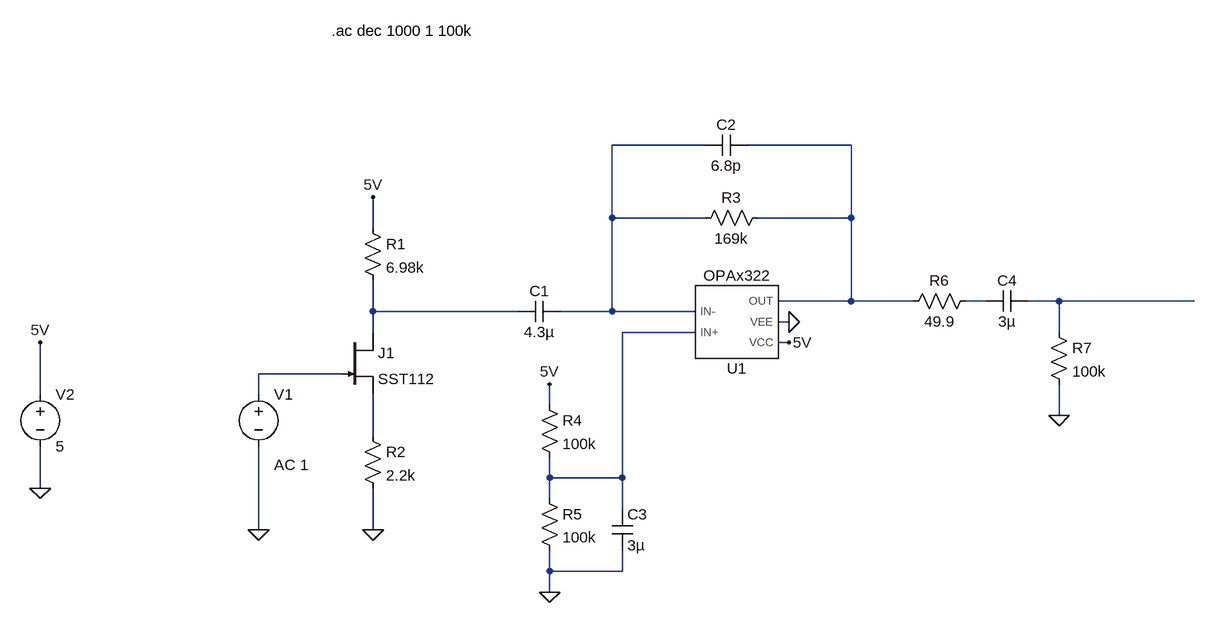
[diagram p0: schematic ac_response.asc]
ac_response.asc, the LTspice schematic file:
Version 4
SHEET 1 1476 680
WIRE 720 -176 576 -176
WIRE 944 -176 784 -176
WIRE 576 -64 576 -176
WIRE 720 -64 576 -64
WIRE 944 -64 944 -176
WIRE 944 -64 800 -64
WIRE 208 -48 208 -96
WIRE 944 64 944 -64
WIRE 944 64 832 64
WIRE 1040 64 944 64
WIRE 1152 64 1120 64
WIRE 1264 64 1216 64
WIRE 1472 64 1264 64
WIRE 208 80 208 32
WIRE 432 80 208 80
WIRE 576 80 576 -64
WIRE 576 80 496 80
WIRE 704 80 576 80
WIRE 848 96 832 96
WIRE 208 112 208 80
WIRE 704 112 592 112
WIRE 1264 112 1264 64
WIRE 848 128 832 128
WIRE 160 176 32 176
WIRE -304 208 -304 128
WIRE 32 208 32 176
WIRE 480 224 480 192
WIRE 1264 240 1264 192
WIRE 208 272 208 208
WIRE 480 336 480 304
WIRE 592 336 592 112
WIRE 592 336 480 336
WIRE -304 352 -304 288
WIRE 480 368 480 336
WIRE 592 384 592 336
WIRE 32 416 32 288
WIRE 208 416 208 352
WIRE 480 480 480 448
WIRE 592 480 592 448
WIRE 592 480 480 480
WIRE 480 512 480 480
FLAG 208 416 0
FLAG 32 416 0
FLAG -304 352 0
FLAG -304 128 5V
FLAG 208 -96 5V
FLAG 480 192 5V
FLAG 480 512 0
FLAG 848 128 5V
FLAG 848 96 0
FLAG 1264 240 0
SYMBOL njf 160 112 R0
SYMATTR InstName J1
SYMATTR Value SST112
SYMBOL OPAx322 768 96 M180
SYMATTR InstName U1
SYMATTR ModelFile C:\Users\aidan\Desktop\Projects\Microphone\Controlled\simulation\OPAx322.LIB
SYMBOL res 192 -64 R0
SYMATTR InstName R1
SYMATTR Value 6.98k
SYMBOL voltage 32 192 R0
WINDOW 123 24 124 Left 2
WINDOW 39 0 0 Left 0
SYMATTR InstName V1
SYMATTR Value ""
SYMATTR Value2 AC 1
SYMBOL res 192 256 R0
SYMATTR InstName R2
SYMATTR Value 2.2k
SYMBOL voltage -304 192 R0
WINDOW 123 0 0 Left 0
WINDOW 39 0 0 Left 0
SYMATTR InstName V2
SYMATTR Value 5
SYMBOL cap 496 64 R90
WINDOW 0 0 32 VBottom 2
WINDOW 3 32 32 VTop 2
SYMATTR InstName C1
SYMATTR Value 4.3µ
SYMBOL res 816 -80 R90
WINDOW 0 0 56 VBottom 2
WINDOW 3 32 56 VTop 2
SYMATTR InstName R3
SYMATTR Value 169k
SYMBOL cap 784 -192 R90
WINDOW 0 0 32 VBottom 2
WINDOW 3 32 32 VTop 2
SYMATTR InstName C2
SYMATTR Value 6.8p
SYMBOL res 464 208 R0
SYMATTR InstName R4
SYMATTR Value 100k
SYMBOL res 464 352 R0
SYMATTR InstName R5
SYMATTR Value 100k
SYMBOL cap 576 384 R0
SYMATTR InstName C3
SYMATTR Value 3µ
SYMBOL res 1136 48 R90
WINDOW 0 0 56 VBottom 2
WINDOW 3 32 56 VTop 2
SYMATTR InstName R6
SYMATTR Value 49.9
SYMBOL cap 1216 48 R90
WINDOW 0 0 32 VBottom 2
WINDOW 3 32 32 VTop 2
SYMATTR InstName C4
SYMATTR Value 3µ
SYMBOL res 1248 96 R0
SYMATTR InstName R7
SYMATTR Value 100k
TEXT 144 -352 Left 2 !.ac dec 1000 1 100k

The netlist it stands for:
* ac_response.asc
J1 N005 N007 N008 SST112
XU1 N006 N001 5V 0 N002 OPAx322  ; pins IN+ IN- VCC VEE OUT
R1 5V N005 6.98k
V1 N007 0 AC 1
R2 N008 0 2.2k
V2 5V 0 5
C1 N001 N005 4.3µ
R3 N002 N001 169k
C2 N002 N001 6.8p
R4 5V N006 100k
R5 N006 0 100k
C3 N006 0 3µ
R6 N003 N002 49.9
C4 N004 N003 3µ
R7 N004 0 100k
.model NJF NJF
.model PJF PJF
.lib standard.jft
.ac dec 1000 1 100k
.lib C:\Users\aidan\Desktop\Projects\Microphone\Controlled\simulation\OPAx322.LIB
.backanno
.end